# Altium project Müh Tas - 1.PrjPCB
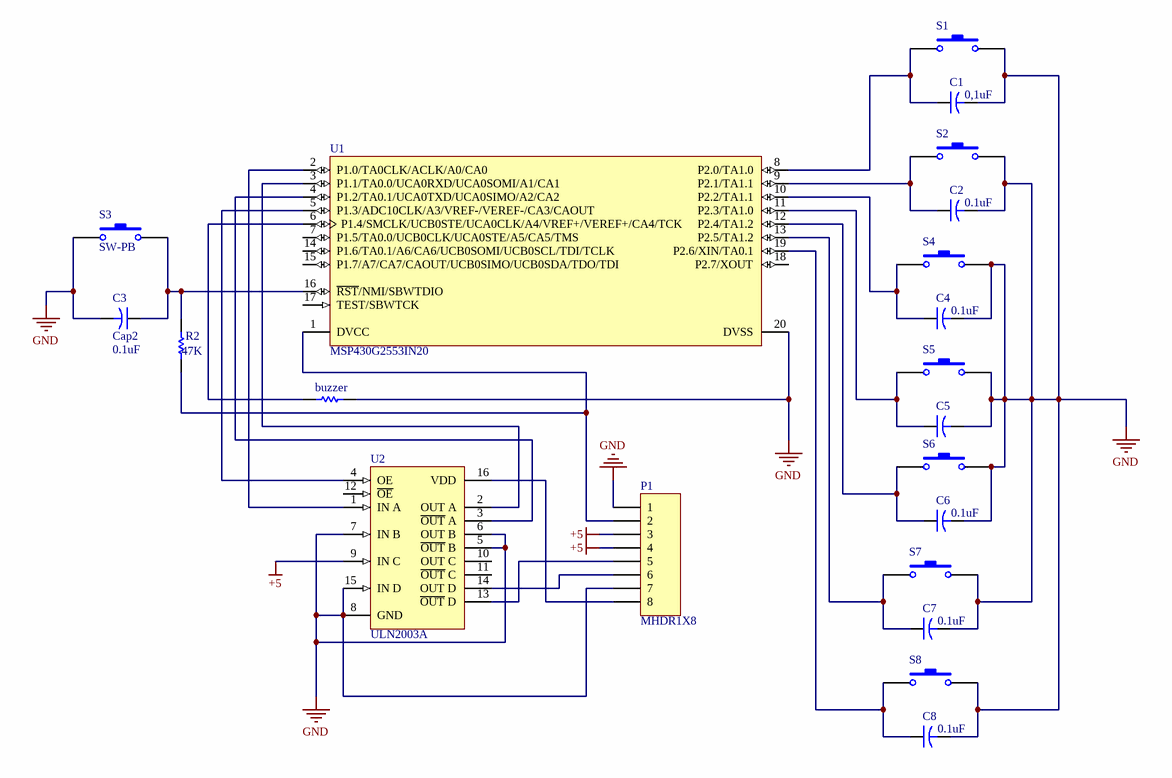
[diagram p0: Müh Tas - 1.SchDoc]
1 sheet, 21 parts. Net scope: global (net labels, ports and power ports of the same name join across sheets).
Board file: Müh Tas - 1.PcbDoc

## Sheet Müh Tas - 1.SchDoc
size A4

### Parts
buzzer  Res1  [AXIAL-0.3]  (value not drawn)
C1  value 0,1uF  [CAPR5-4X5]  (hidden comment: Cap2)
C2  value 0.1uF  [CAPR5-4X5]  (hidden comment: Cap2)
C3  Cap2  value 0.1uF  [CAPR5-4X5]
C4  value 0.1uF  [CAPR5-4X5]  (hidden comment: Cap2)
C5  Cap2  [CAPR5-4X5]  (value not drawn)
C6  value 0.1uF  [CAPR5-4X5]  (hidden comment: Cap2)
C7  value 0.1uF  [CAPR5-4X5]  (hidden comment: Cap2)
C8  value 0.1uF  [CAPR5-4X5]  (hidden comment: Cap2)
P1  MHDR1X8  [MHDR1X8]
R2  value 47K  [AXIAL-0.3]  (hidden comment: Res1)
S1  SW-PB  [SPST-2]  (value not drawn)
S2  SW-PB  [SPST-2]  (value not drawn)
S3  SW-PB  [SPST-2]
S4  SW-PB  [SPST-2]  (value not drawn)
S5  SW-PB  [SPST-2]  (value not drawn)
S6  SW-PB  [SPST-2]  (value not drawn)
S7  SW-PB  [SPST-2]  (value not drawn)
S8  SW-PB  [SPST-2]  (value not drawn)
U1  MSP430G2553IN20  [TI-N20]
U2  ULN2003A  [620-10]

### Nets
+5: P1.3 P1.4 U2.9(IN_C)
GND: buzzer.2 C1.2 C2.2 C3.2 C4.2 C5.2 C6.2 C7.2 C8.2 P1.1 P1.7 S1.2 S2.2 S3.1 S4.2 S5.2 S6.2 S7.2 S8.2 U1.20(DVSS) U2.5(~{OUT}_B) U2.6(OUT_B) U2.7(IN_B) U2.8(GND) U2.15(IN_D)
Netbuzzer_1: buzzer.1 U1.6(P1.4/SMCLK/UCB0STE/UCA0CLK/A4/VREF+/VEREF+/CA4/TCK)
NetC1_1: C1.1 S1.1 U1.8(P2.0/TA1.0)
NetC2_1: C2.1 S2.1 U1.9(P2.1/TA1.1)
NetC3_1: C3.1 R2.1 S3.2 U1.16(~{RST}/NMI/SBWTDIO)
NetC4_1: C4.1 S4.1 U1.10(P2.2/TA1.1)
NetC5_1: C5.1 S5.1 U1.11(P2.3/TA1.0)
NetC6_1: C6.1 S6.1 U1.12(P2.4/TA1.2)
NetC7_1: C7.1 S7.1 U1.13(P2.5/TA1.2)
NetC8_1: C8.1 S8.1 U1.19(P2.6/XIN/TA0.1)
NetP1_2: P1.2 R2.2 U1.1(DVCC)
NetP1_5: P1.5 U2.13(~{OUT}_D)
NetP1_6: P1.6 U2.14(OUT_D)
NetP1_8: P1.8 U2.16(VDD)
NetU1_2: U1.2(P1.0/TA0CLK/ACLK/A0/CA0) U2.1(IN_A)
NetU1_3: U1.3(P1.1/TA0.0/UCA0RXD/UCA0SOMI/A1/CA1) U2.2(OUT_A)
NetU1_4: U1.4(P1.2/TA0.1/UCA0TXD/UCA0SIMO/A2/CA2) U2.3(~{OUT}_A)
NetU1_5: U1.5(P1.3/ADC10CLK/A3/VREF-/VEREF-/CA3/CAOUT) U2.4(OE)

Not connected (* = marked no-connect by the designer): U1 7(P1.5/TA0.0/UCB0CLK/UCA0STE/A5/CA5/TMS) 14(P1.6/TA0.1/A6/CA6/UCB0SOMI/UCB0SCL/TDI/TCLK) 15(P1.7/A7/CA7/CAOUT/UCB0SIMO/UCB0SDA/TDO/TDI) 17(TEST/SBWTCK) 18(P2.7/XOUT); U2 10(OUT_C) 11(~{OUT}_C) 12(~{OE})

### Library data of the parts
buzzer R2 = Res1: Resistor; Published: 8-Jun-2000; LatestRevisionDate: 17-Jul-2002; LatestRevisionNote: Re-released for DXP Platform.; PackageReference: AXIAL-0.3; Publisher: Altium Limited; PackageDescription: Axial Device, Thru-Hole; 2 Leads; 0.3 in Pin Spacing
C1-C8 = Cap2: Capacitor; Published: 23-Sep-2002; PackageReference: CAPR5-4X5; Publisher: Altium Limited; PackageDescription: Capacitor; 2 Leads
P1 = MHDR1X8: Header, 8-Pin; LatestRevisionDate: 17-Jul-2002; LatestRevisionNote: Re-released for DXP Platform.; Publisher: Altium Limited
S1-S8 = SW-PB: Switch; Published: 24-Mar-1999; LatestRevisionDate: 17-Jul-2002; LatestRevisionNote: Re-released for DXP Platform.; PackageReference: SPST-2; Publisher: Altium Limited; PackageDescription: Switch; 2 Leads
U1 = MSP430G2553IN20: 16 MHz Mixed Signal Microcontroller with 16 KB Flash, 512 B SRAM and 24 GPIOs, -40 to 85 degC, 20-pin DIP (N), Pb-Free (RoHS); Manufacturer: Texas Instruments; ADC: 10-bit SAR; ADC Channels: 8; Brown Out Reset: Yes; Flash(KB): 16; GPIO: 24; SRAM(B): 512; SubFamily: Value Line; Timers - 16-bit: 2; USCI_A (UART/LIN/IrDA/SPI): 1; DatasheetVersion: SLAS735G; PackageVersion: 4040049/E; PackageReference: N20; PackageDescription: 20-Pin Plastic In-Line, Body 25.40 x 6.35 mm, Pitch 2.54 mm; Supplier 1: Digi-Key; Supplier Part Number 1: MSP430G2533IRHB32T-ND; Supplier 2: Mouser; Supplier Part Number 2: 595-P430G2533IRHB32T; Cap touch I/O: Yes; Comparators: Yes; Eco-Plan: Pb-Free (RoHS); Frequency(MHz): 16; Temp Sensor: Yes; USCI_B (I2C & SPI): 1; Watchdog: Yes; Mounting Technology: Through Hole; Code_JEDEC: MS-001; PartNumber: MSP430G2553IN20; ComponentLink1Description: Manufacturer URL; ComponentLink1URL: http://www.ti.com/; ComponentLink2Description: Datasheet; ComponentLink2URL: http://www.ti.com/general/docs/lit/getliterature.tsp?genericPartNumber=MSP430G2553&fileType=pdf; ComponentLink3Description: Package Specification; ComponentLink3URL: http://www.ti.com/litv/pdf/mpds177g
U2 = AM26LS31DC: Quad EIA-422 Line Driver with Three-State Output; Published: 17-Jul-2002; LatestRevisionDate: 06-Jun-2005; LatestRevisionNote: Stylized 3D Model Added; DatasheetVersion: 1988; PackageReference: 620-10; Publisher: Altium Limited; PackageDescription: DIP; 16 Leads; Row Spacing 7.62 mm; Pitch 2.54 mm; ComponentLink1Description: Manufacturer Link; ComponentLink1URL: http://www.onsemi.com/site/products/parametrics/0,4446,178,00.html